# EAGLE design 3pdt opto buffer smd 1 (EAGLE 9.5.2)
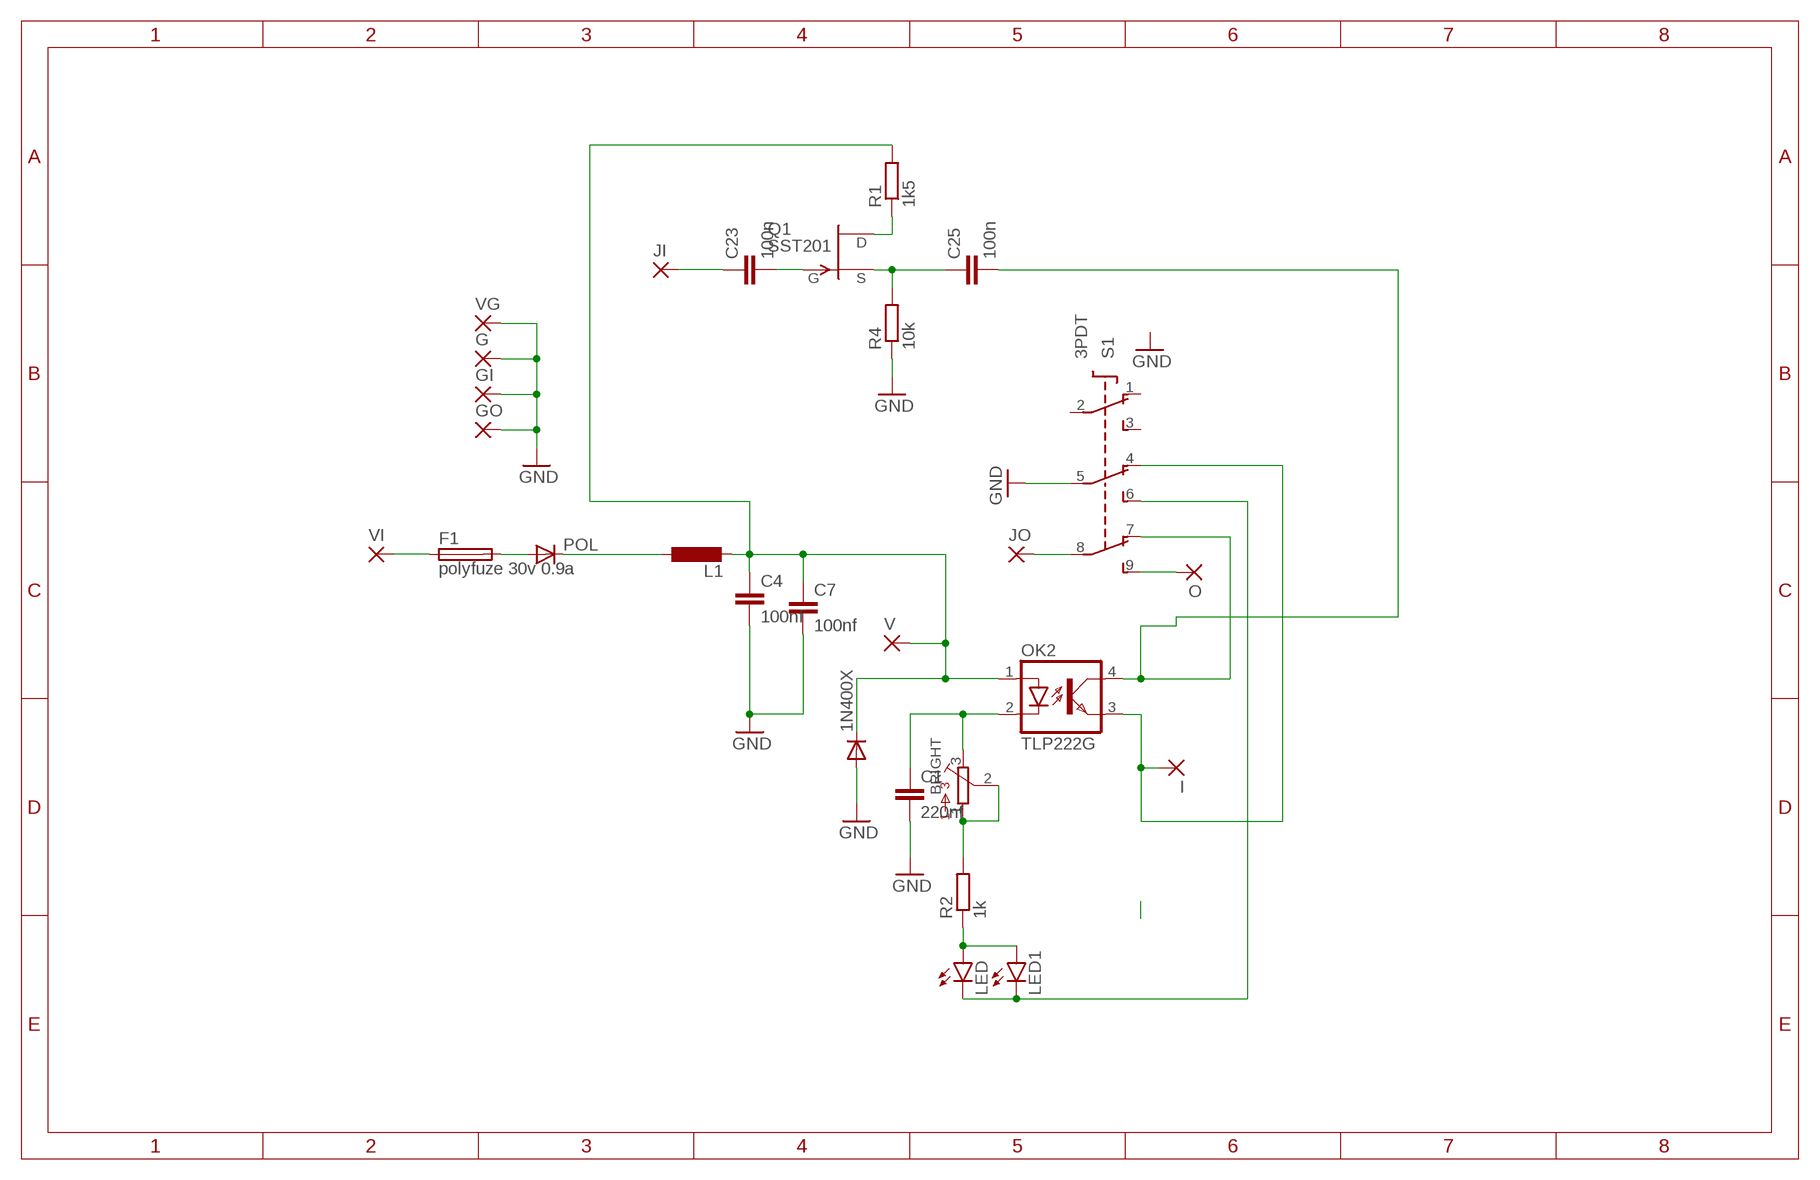
[diagram p0: schematic, sheet 1]

## Parts
1N400X  SMALL_DIODEDO35-7  [DO35-7]
BRIGHT  BOURNS_3362P_TRIMMERP  [BOURNS_3362P_TRIMMER]
C1  220nf  C-EUC0805K  [C0805K]
C4  100nf  C-EUC0805K  [C0805K]
C7  100nf  C-EUC0805K  [C0805K]
C23  100n  C-EUC0805K  [C0805K]
C25  100n  C-EUC0805K  [C0805K]
F1  polyfuze 30v 0.9a  19559  [19559]
G  2,15/1,0  [2,15/1,0]
GI  2,15/1,0  [2,15/1,0]
GO  2,15/1,0  [2,15/1,0]
I  2,15/1,0  [2,15/1,0]
JI  2,15/1,0  [2,15/1,0]
JO  2,15/1,0  [2,15/1,0]
L1  L-EU0204/7  [0204/7]
LED  LED3MM  [LED3MM]
LED1  LED3MM  [LED3MM]
O  2,15/1,0  [2,15/1,0]
OK2  TLP222G  PC817  [DIL04]
POL  SMALL_DIODEDO35-7  [DO35-7]
Q1  SST201  [SOT23]
R1  1k5  R-EU_M1206  [M1206]
R2  1k  R-EU_M1206  [M1206]
R4  10k  R-EU_M1206  [M1206]
S1  3PDT  [3PDT]
V  2,15/1,0  [2,15/1,0]
VG  2,15/1,0  [2,15/1,0]
VI  2,15/1,0  [2,15/1,0]

## Nets
GND: 1N400X.A C1.2 G.1(P) GI.1(P) GO.1(P) R4.1 S1.5(P2) VG.1(P)
N$1: JO.1(P) S1.8(P3)
N$2: BRIGHT.3 C1.1 OK2.2(C)
N$4: LED1.K(C) LED.K(C) S1.6(S2)
N$5: LED1.A LED.A R2.1
N$6: F1.1 VI.1(P)
N$7: O.1(P) S1.9(S3)
N$8: L1.1 POL.C
N$9: I.1(P) OK2.3(EMIT) S1.4(O2)
N$10: C4.2 C7.2 ; supply symbol labelled GND
N$11: BRIGHT.1 BRIGHT.2 R2.2
N$17: F1.2 POL.A
N$56: C25.1 Q1.2(S) R4.2
N$57: C23.2 Q1.3(G)
N$58: C23.1 JI.1(P)
N$59: C25.2 OK2.4(COL) S1.7(O3)
N$60 [VCC]: Q1.1(D) R1.1
VCC1: 1N400X.C C4.1 C7.1 L1.2 OK2.1(A) R1.2 V.1(P)
Unconnected: S1.1(O1) S1.2(P1) S1.3(S1)

## Library data of the parts
1N400X POL = module jack 3.5mm:SMALL_DIODE: Small Signal Diode
BRIGHT = MusicThingModular:BOURNS_3362P_TRIMMER: 3362 Series 1/4" Square Trimmer
C1 C4 C7 = hexresistor2:C-EU: CAPACITOR, European symbol; SPICEPREFIX: C
C23 C25 = hexresistor:C-EU: CAPACITOR, European symbol; SPICEPREFIX: C
F1 = fuse:19559: FUSE HOLDER TR5, Wickmann; MPN: 55900000001; OC_FARNELL: 9516360; OC_NEWARK: 02P0286
G GI GO I JI JO O V VG VI = wirepad:2,15/1,0: THROUGH-HOLE PAD
L1 = hexresistor:L-EU: INDUCTOR, European symbol; SPICEPREFIX: L
LED LED1 = led:LED: LED OSRAM: - CHIPLED LG R971, LG N971, LY N971, LG Q971, LY Q971, LO R971, LY R971 LH N974, LH R974 LS Q976, LO Q976, LY Q976 LO Q996 - Hyper CHIPLED LW Q18S LB Q993, LB Q99A, LB R99A - SideLED LS A670, LO A670, LY A670, LG A670, LP A670 LB A673, LV A673, LT A673, LW A673 LH A674 LY A675 LS A676, LA A676, LO A676, LY A676, LW A676 LS A679, LY A679, LG A679 - Hyper Micro SIDELED® LS Y876, LA Y876, LO Y876, LY Y876 LT Y87S - SmartLED LW L88C, LW L88S LB L89C, LB L89S, LG L890 LS L89K, LO L89K, LY L89K LS L896, LA L896, LO L896, LY L896 - TOPLED LS T670, LO T670, LY T670, LG T670, LP T670 LSG T670, LSP T670, LSY T670, LOP T670, LYG T670 LG T671, LOG T671, LSG T671 LB T673, LV T673, LT T673, LW T673 LH T674 LS T676, LA T676, LO T676, LY T676, LB T676, LH T676, LSB T676, LW T676 LB T67C, LV T67C, LT T67C, LS T67K, LO T67K, LY T67K, LW E67C LS E67B, LA E67B, LO E67B, LY E67B, LB E67C, LV E67C, LT E67C LW T67C LS T679, LY T679, LG T679 LS T770, LO T770, LY T770, LG T770, LP T770 LB T773, LV T773, LT T773, LW T773 LH T774 LS E675, LA E675, LY E675, LS T675 LS T776, LA T776, LO T776, LY T776, LB T776 LHGB T686 LT T68C, LB T68C - Hyper Mini TOPLED® LB M676 - Mini TOPLED Santana® LG M470 LS M47K, LO M47K, LY M47K Source: http://www.osram.convergy.de LUXEON: - LUMILED® LXK2-PW12-R00, LXK2-PW12-S00, LXK2-PW14-U00, LXK2-PW14-V00 LXK2-PM12-R00, LXK2-PM12-S00, LXK2-PM14-U00 LXK2-PE12-Q00, LXK2-PE12-R00, LXK2-PE12-S00, LXK2-PE14-T00, LXK2-PE14-U00 LXK2-PB12-K00, LXK2-PB12-L00, LXK2-PB12-M00, LXK2-PB14-N00, LXK2-PB14-P00, LXK2-PB14-Q00 LXK2-PR12-L00, LXK2-PR12-M00, LXK2-PR14-Q00, LXK2-PR14-R00 LXK2-PD12-Q00, LXK2-PD12-R00, LXK2-PD12-S00 LXK2-PH12-R00, LXK2-PH12-S00 LXK2-PL12-P00, LXK2-PL12-Q00, LXK2-PL12-R00 Source: www.luxeon.com KINGBRIGHT: KA-3528ASYC Source: www.kingbright.com
OK2 = optocoupler:PC817: SHARP OPTO COUPLER; MPN: PC817X4J000F; OC_FARNELL: 9707727; OC_NEWARK: 97K7059
Q1 = transistor-fet:?20*: TEMIC / Siliconix N-Channel JFET Source: JFET-J201_Siliconix_data.pdf
R1 R2 R4 = rcl:R-EU_: RESISTOR, European symbol; SPICEPREFIX: R
S1 = switch:3PDT: 3PDT 9 pin footswitch SF17020F-0302-21R-L Source: 3PDT.jpg

## Net classes
0 default: width 0.254 mm
2 VCC: width 0.457 mm

## Board
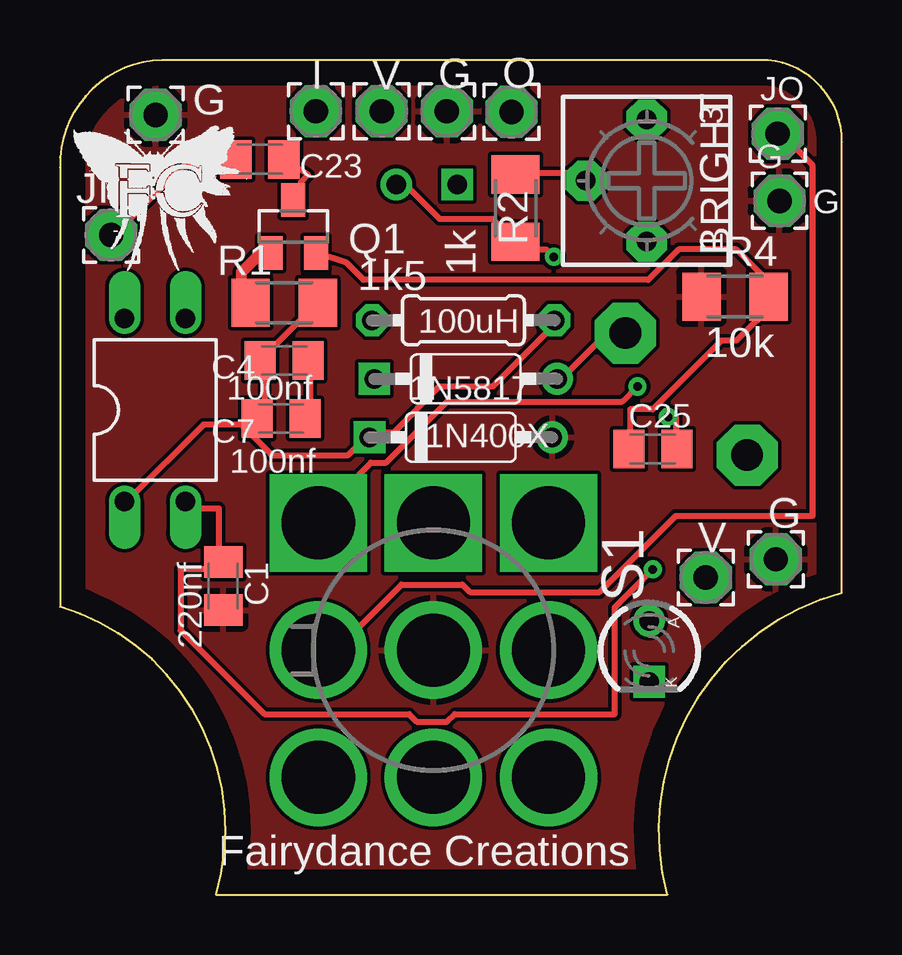
[diagram p1: board, top side]
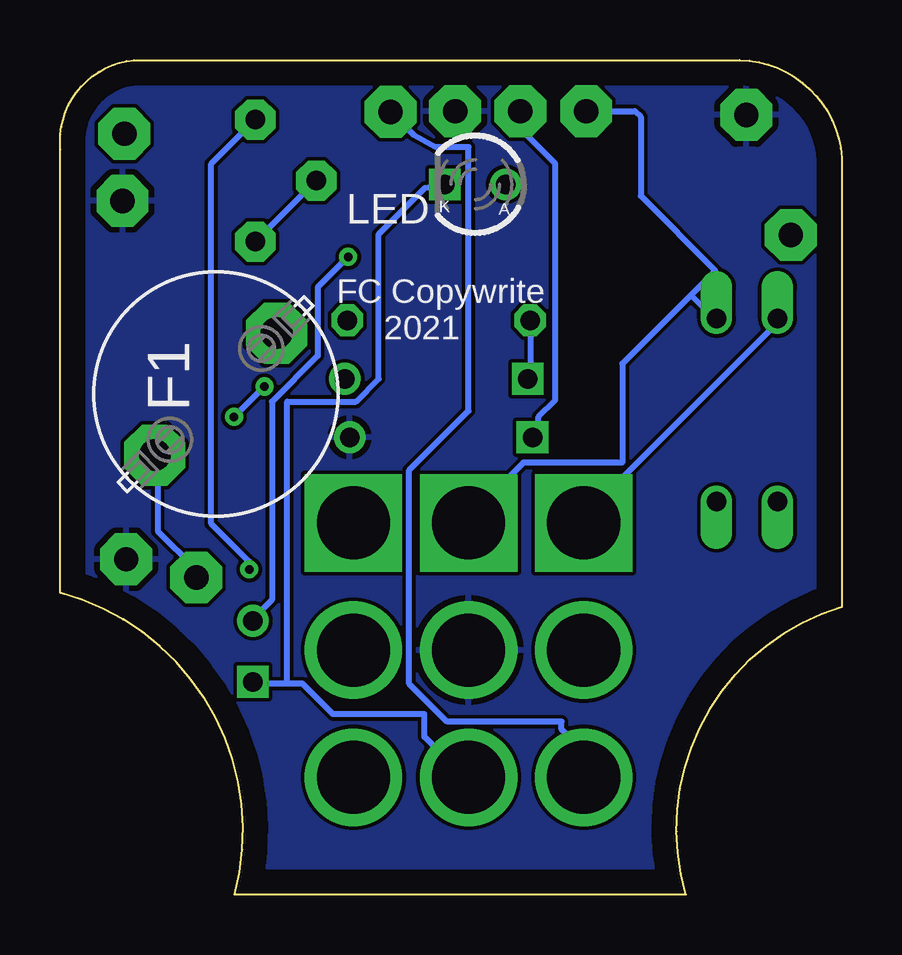
[diagram p2: board, bottom side, seen from below]

Size 32.6 x 34.77 mm. Coordinates in mm from the lower left corner, seen from the top.
Outline: 0,30.3 0,11.99 arc-90 6.5,0 25.32,0 arc-90 32.59,12.57 32.59,31.04 arc90 29.52,34.77 4.27,34.77 arc90 0,30.3
Copper layers (1*16): Top 0.035mm / dielectric 1.5mm / Bottom 0.035mm
Design rules "default": minimum track width 6mil, minimum drill 0.35mm, track to track 6mil, track to pad 6mil, pad to pad 6mil, via to via 6mil, smd to smd 6mil, copper to edge 40mil, drill to drill 6mil, minimum pad ring 10mil, minimum via ring 8mil, stop-mask expansion 4mil, vias tented up to drill 0mil, thermal gap 10mil

### Footprints (pad centres in the part's own frame; a part is rotated, then mirrored left to right if it is on the bottom)
DO35-7 = drill 0.813: A 3.81,0 | drill 0.813 square: C -3.81,0
BOURNS_3362P_TRIMMER = drill 0.813 pad 1.676 octagon: 1 -2.54,0; 2 0,2.54; 3 2.54,0
C0805K = smd 1.3 x 1.6: 1 -1,0; 2 1,0
19559 = drill 1.321 pad 2.54 octagon: 1 -2.54,2.54; 2 2.54,-2.54
2,15/1,0 = drill 1.016 pad 2.159 octagon: 1 0,0
0204/7 = drill 0.813 octagon: 1 -3.81,0; 2 3.81,0
LED3MM = drill 0.813 pad 1.27: A -1.27,0 | drill 0.813 pad 1.27 square: K 1.27,0
DIL04 = drill 0.813 offset: 1 -1.27,-3.81; 2 1.27,-3.81; 3 1.27,3.81; 4 -1.27,3.81
SOT23 = smd 1 x 1.4: 1 -0.95,-1.1; 2 0.95,-1.1; 3 0,1.1
M1206 = smd 1.6 x 2: 1 -1.4,0; 2 1.4,0
3PDT = drill 3.048 pad 3.81 square: 1 -5.3,4.8; 4 -5.3,0; 7 -5.3,-4.8 | drill 3.048 pad 3.81: 2 0,4.8; 3 5.3,4.8; 5 0,0; 6 5.3,0; 8 0,-4.8; 9 5.3,-4.8

### Placement (x,y rotation side)
1N400X  16.71,19.05 0 top
BRIGHT  24.46,29.74 90 top
C1  6.81,12.85 270 top
C4  9.35,22.25 0 top
C7  9.22,19.84 0 top
C23  8.33,30.63 0 top
C25  24.71,18.57 0 top
F1  26.11,20.85 90 bottom
G  16.13,32.64 0 top
GI  3.99,32.49 0 top
GO  30,28.91 0 top
I  10.67,32.64 0 top
JI  2.13,27.48 0 top
JO  29.92,31.7 0 top
L1  16.81,23.93 0 top
LED  15.29,29.59 180 bottom
LED1  24.56,10.13 270 top
O  18.82,32.61 0 top
OK2  3.96,20.19 0 top
POL  16.92,21.49 0 top
Q1  9.73,27.84 0 top
R1  9.35,24.66 0 top
R2  19,28.6 90 top
R4  28.14,24.92 0 top
S1  15.57,10.19 270 top
V  13.41,32.64 0 top
VG  29.84,13.97 0 top
VI  26.92,13.21 0 top

### Tracks (layer width: path | path; a pad name or v marks a point on that pad's centre or on a via)
GND
  pour Bottom: -1.96,35.46 -1.96,10.69 -1.32,10.06 3.12,5.61 3.12,0.53 3.12,-2.64 31.7,-2.64 32.97,-1.37 32.97,36.73 -0.69,36.73
  pour Top: -5.89,38 -5.89,-0.36 -4.88,-1.37 25.98,-1.37 36.78,9.42 36.78,32.92 31.7,38
N$1
  Top 0.254: JO.1 30.06,31.7 31.38,30.38 31.38,15.77 25.67,15.77 22.49,12.6 17.09,12.6 16.78,12.92 14.24,12.92 11.7,10.38 11.06,10.38 S1.8
N$2  (via drill 0.35)
  Top 0.254: OK2.2 5.35,16.09 6.62,16.09 6.62,13.87 C1.1 6.62,13.55 5.03,13.55 5.03,11.01 8.52,7.52 14.55,7.52 14.87,7.2 16.14,7.2 16.46,7.52 23.13,7.52 23.13,11.96 v24.71,13.55
  Bottom 0.254: BRIGHT.3 26.3,30.44 26.3,15.46 24.71,13.87 v24.71,13.55
N$4
  Bottom 0.254: 23.13,8.79 22.49,8.79 21.22,7.52 17.41,7.52 17.41,6.57 15.82,4.98 S1.6 | 23.13,8.79 24.4,8.79 LED1.K | 23.13,8.79 23.13,20.54 20.27,20.54 19.32,21.49 19.32,27.52 17.39,29.44 LED.K
N$5  (via drill 0.35)
  Top 0.254: LED.A 14.12,29.86 15.82,28.16 18.05,28.16 R2.1 19,26.89 20.27,26.89 v20.59,26.57
  Bottom 0.254: v20.59,26.57 21.86,25.3 21.86,22.44 23.76,20.54 23.76,12.28 24.4,11.65 LED1.A
N$6
  Bottom 0.254: VI.1 26.97,13.59 28.52,15.14 28.52,18.31 F1.1
N$7
  Bottom 0.254: O.1 17.86,31.65 16.93,31.14 15.57,31.14 15.57,20.16 18.05,17.68 18.05,8.79 16.46,7.2 11.7,7.2 11.7,6.88 11.06,6.25 11.06,4.98 S1.9
N$8
  Bottom 0.254: L1.1 12.97,23.71 12.97,21.49 POL.C
N$9
  Bottom 0.254: 6.3,24.98 5.35,24.03 OK2.3 | I.1 8.64,32.64 8.4,32.4 8.4,29.11 5.28,26 6.3,24.98 | 6.3,24.98 9.16,22.12 9.16,18 13.28,18 15.51,15.77 S1.4
N$10
  Top 0.254: C7.2 10.43,19.9 10.43,22.12 C4.2
N$11
  Top 0.254: R2.2 19,30.06 21.6,30.06 BRIGHT.2
  Bottom 0.254: BRIGHT.2 BRIGHT.1
N$17
  Top 0.254: F1.2 22.81,23.39 20.9,21.49 POL.A
N$56
  Top 0.254: Q1.2 11.95,26.32 12.65,25.62 24.52,25.62 25.79,26.89 28.21,26.89 29.48,25.62 29.48,24.98 R4.2 29.79,24.66 28.21,23.08 27.57,23.08 24.71,20.22 23.76,20.22 23.76,18.63 C25.1
N$57
  Top 0.254: Q1.3 10.05,29.68 10.35,29.99 C23.2
N$58
  Top 0.254: C23.1 7.01,30.31 5.09,30.31 2.26,27.48 JI.1
N$59  (via drill 0.35)
  Top 0.254: v25.35,19.9 25.67,19.9 25.67,18.63 C25.2 | v24.08,21.17 23.44,20.54 16.14,20.54 13.6,18 12.97,18 10.74,15.77 S1.7
  Bottom 0.254: v24.08,21.17 v25.35,19.9 | OK2.4 2.81,23.71 10.74,15.77 S1.7
N$60
  Top 0.457: R1.1 7.57,24.66 7.57,25.93 8.26,26.62 Q1.1
VCC1
  Top 0.254: R1.2 8.52,22.44 C4.1 8.52,22.12 8.52,19.9 C7.1 8.2,19.58 7.57,19.58 | 7.57,19.58 5.98,19.58 2.81,16.41 OK2.1 | 7.57,19.58 8.84,18.31 12.01,18.31 12.65,18.95 1N400X.C 12.97,19.27 13.92,19.27 15.82,21.17 18.05,21.17 20.59,23.71 L1.2
  Bottom 0.254: V.1 13.41,31.9 11.95,30.44 11.95,20.6 12.65,19.9 12.65,19.27 1N400X.C

### Text on the board
bPlace: FC Copywrite / 2021
tNames: JO | G | G | G | 100uH | 1N5817 | G | V | Fairydance Creations